# EAGLE design OSO-SAFE-C1-02 (EAGLE 9.4.2)
COMPANY: ADAFRUIT INDUSTRIES; DRAWN: KTOWN; REV: B
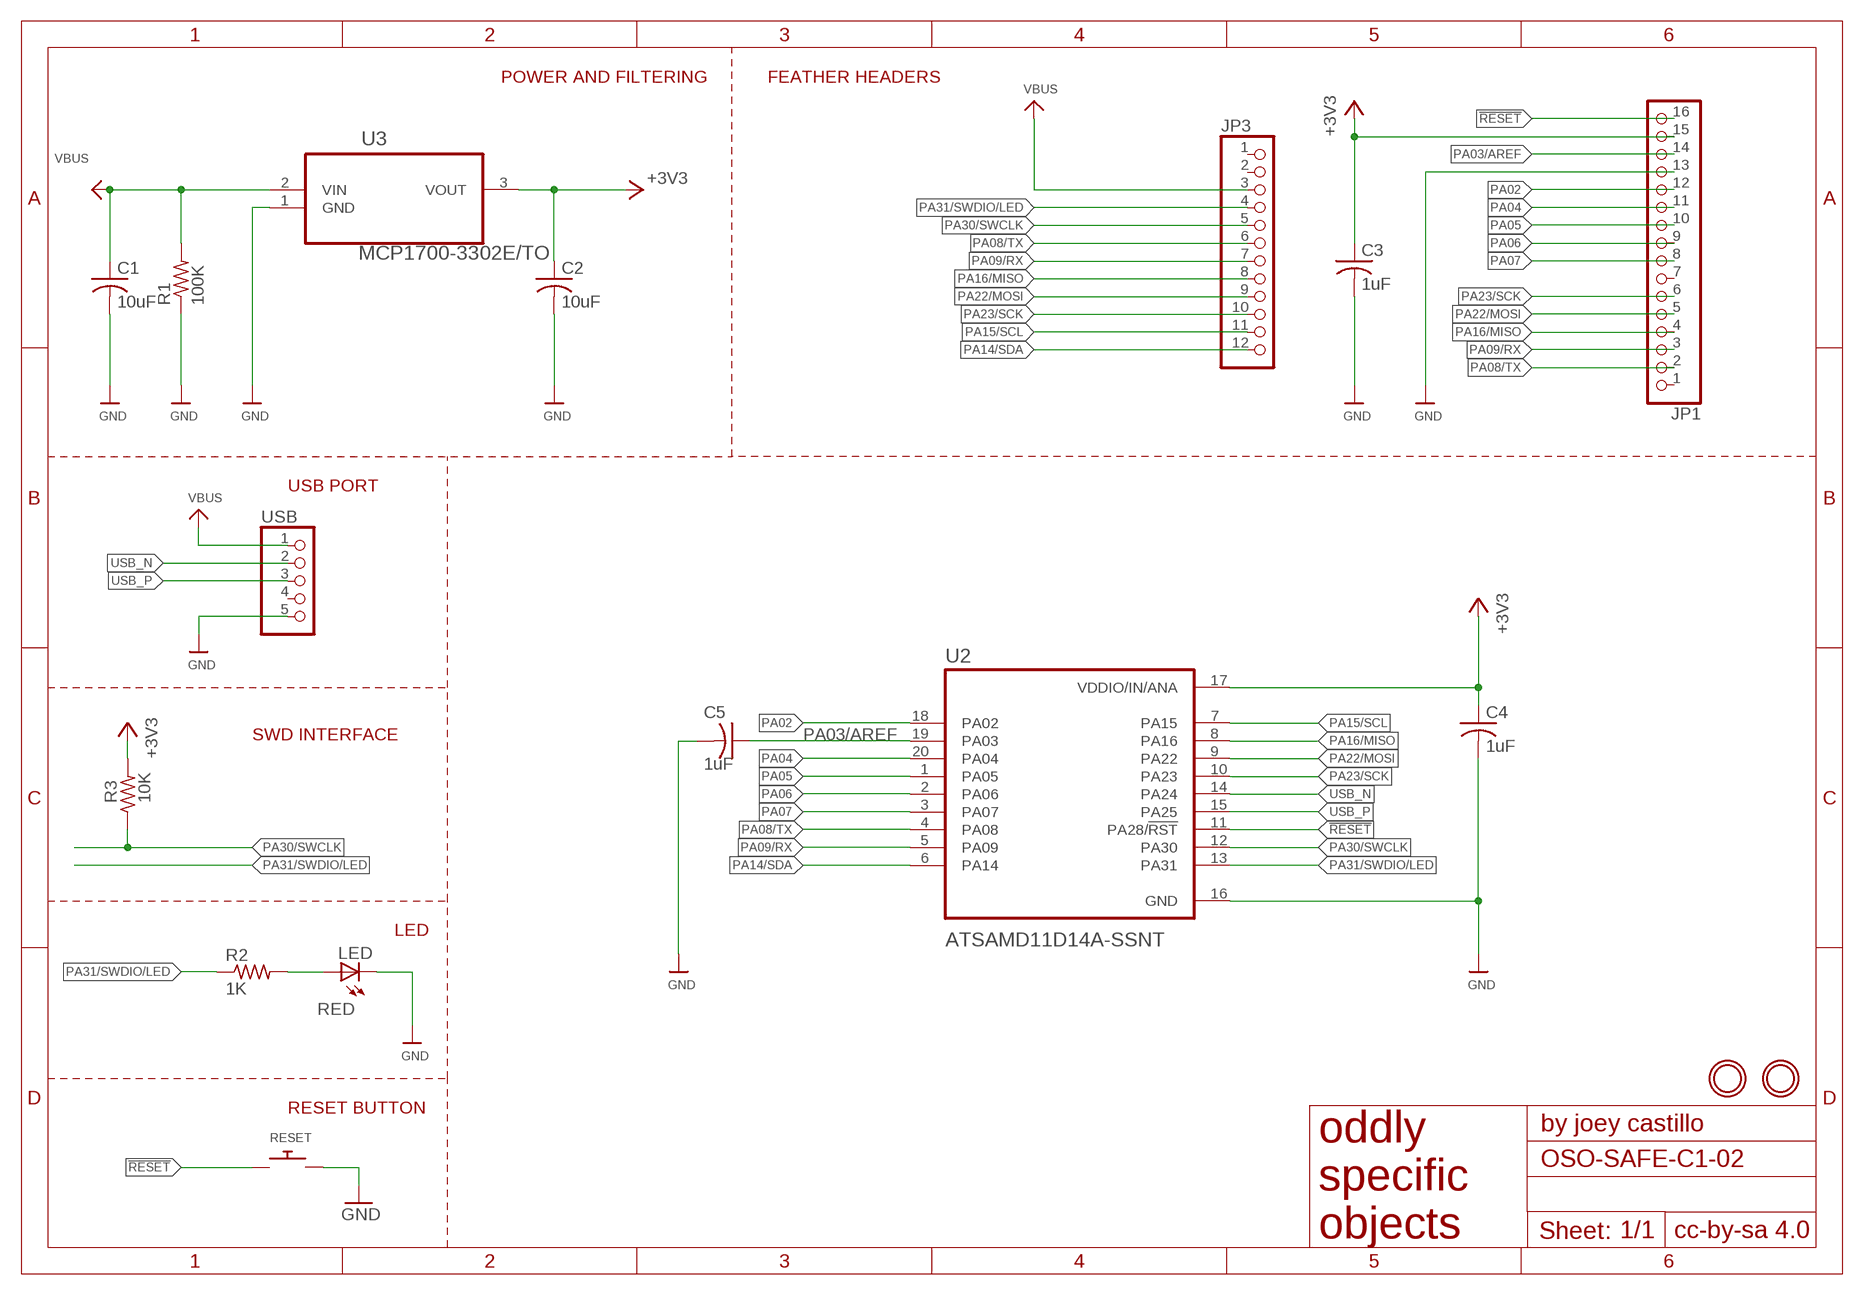
[diagram p0: schematic, sheet 1]

## Parts
C1  10uF  C-US050-025X075  [C050-025X075]
C2  10uF  C-US050-025X075  [C050-025X075]
C3  1uF  C-US025-025X050  [C025-025X050]
C4  1uF  C-US025-025X050  [C025-025X050]
C5  1uF  C-US025-025X050  [C025-025X050]
JP1  HEADER-1X16_MIN  [1X16_ROUND_MIN]
JP3  HEADER-1X12_MIN  [1X12_ROUND_MIN]
LED  RED  LED3MM  [LED3MM]
R1  100K  R-US_0207/9  [0207/9]
R2  1K  R-US_0207/9  [0207/9]
R3  10K  R-US_0207/9  [0207/9]
RESET  SWITCH_PUSHBUTTONEVQ-PE  [TACT_PANA-EVQ]
U2  ATSAMD11D14A-SSNT  [SOIC127P1030X265-20N]
U3  MCP1700-3302E/TO  [TO127P254X495-3]
U$10  MOUNTINGHOLE2.5  [MOUNTINGHOLE_2.5_PLATED]
U$32  MOUNTINGHOLE2.5  [MOUNTINGHOLE_2.5_PLATED]
USB  PINHD-1X5  [1X05]

## Nets
!RESET: JP1.16 RESET.P$1 U2.11(PA28/!RST)
+3V3 [power]: C2.1 C3.1 C4.1 JP1.15 R3.2 U2.17(VDDIO/IN/ANA) U3.3(VOUT)
GND [gnd]: C1.2 C2.2 C3.2 C4.2 C5.2 JP1.13 LED.K(C) R1.1 RESET.P$2 U2.16(GND) U3.1(GND) USB.5
N$1: LED.A R2.2
PA02: JP1.12 U2.18(PA02)
PA03/AREF: C5.1 JP1.14 U2.19(PA03)
PA04: JP1.11 U2.20(PA04)
PA05: JP1.10 U2.1(PA05)
PA06: JP1.9 U2.2(PA06)
PA07: JP1.8 U2.3(PA07)
PA08/TX: JP1.2 JP3.6 U2.4(PA08)
PA09/RX: JP1.3 JP3.7 U2.5(PA09)
PA14/SDA: JP3.12 U2.6(PA14)
PA15/SCL: JP3.11 U2.7(PA15)
PA16/MISO: JP1.4 JP3.8 U2.8(PA16)
PA22/MOSI: JP1.5 JP3.9 U2.9(PA22)
PA23/SCK: JP1.6 JP3.10 U2.10(PA23)
PA30/SWCLK: JP3.5 R3.1 U2.12(PA30)
PA31/SWDIO/LED: JP3.4 R2.1 U2.13(PA31)
USB_N: U2.14(PA24) USB.2
USB_P: U2.15(PA25) USB.3
VBUS [power]: C1.1 JP3.3 R1.2 U3.2(VIN) USB.1
Unconnected: JP1.1 JP1.7 JP3.1 JP3.2 USB.4

## Notes on the sheet
- POWER AND FILTERING | FEATHER HEADERS
- USB PORT
- SWD INTERFACE
- LED
- RESET BUTTON

## Library data of the parts
C1-C5 = adafruit:C-US: CAPACITOR, American symbol
JP1 = microbuilder:HEADER-1X16: PIN HEADER
JP3 = microbuilder:HEADER-1X12
LED = adafruit:LED: LED OSRAM: - CHIPLED LG R971, LG N971, LY N971, LG Q971, LY Q971, LO R971, LY R971 LH N974, LH R974 LS Q976, LO Q976, LY Q976 LO Q996 - Hyper CHIPLED LW Q18S LB Q993, LB Q99A, LB R99A - SideLED LS A670, LO A670, LY A670, LG A670, LP A670 LB A673, LV A673, LT A673, LW A673 LH A674 LY A675 LS A676, LA A676, LO A676, LY A676, LW A676 LS A679, LY A679, LG A679 - Hyper Micro SIDELED® LS Y876, LA Y876, LO Y876, LY Y876 LT Y87S - SmartLED LW L88C, LW L88S LB L89C, LB L89S, LG L890 LS L89K, LO L89K, LY L89K LS L896, LA L896, LO L896, LY L896 - TOPLED LS T670, LO T670, LY T670, LG T670, LP T670 LSG T670, LSP T670, LSY T670, LOP T670, LYG T670 LG T671, LOG T671, LSG T671 LB T673, LV T673, LT T673, LW T673 LH T674 LS T676, LA T676, LO T676, LY T676, LB T676, LH T676, LSB T676, LW T676 LB T67C, LV T67C, LT T67C, LS T67K, LO T67K, LY T67K, LW E67C LS E67B, LA E67B, LO E67B, LY E67B, LB E67C, LV E67C, LT E67C LW T67C LS T679, LY T679, LG T679 LS T770, LO T770, LY T770, LG T770, LP T770 LB T773, LV T773, LT T773, LW T773 LH T774 LS E675, LA E675, LY E675, LS T675 LS T776, LA T776, LO T776, LY T776, LB T776 LHGB T686 LT T68C, LB T68C - Hyper Mini TOPLED® LB M676 - Mini TOPLED Santana® LG M470 LS M47K, LO M47K, LY M47K Source: http://www.osram.convergy.de/
R1-R3 = adafruit:R-US_: RESISTOR, American symbol
RESET = adafruit:SWITCH_PUSHBUTTON: Buttons SOFTTOUCHSMD_SJ - Soft touch temporary push button (Super Junk Akihabara) Compatible with SKPMANE010 [Mouser: 688-SKPMAN] C&K_KSS = Digikey: KSS221GLFS
U2 = ATSAMD11D14A-SSNT:ATSAMD11D14A-SSNT: None; AVAILABILITY: Unavailable; DESCRIPTION: Cortex-M0+, 16kb Flash, 4kb Sram, Usb - 20 Soic, 105c, Green, 1.6-3.6v, 48mhz, Usb/ Eiqj/Soic _s_; MF: Microchip; MP: ATSAMD11D14A-SSNT; PACKAGE: SOIC-20 Atmel; PRICE: None
U3 = MCP1700-3302E_TO:MCP1700-3302E/TO: IC LDO REG 250MA 5.0V; DESCRIPTION: Linear Voltage Regulator IC 1 Output 250mA TO-92-3; DIGI-KEY_PART_NUMBER: MCP1700-3302E/TO-ND; DIGI-KEY_PURCHASE_URL: https://www.digikey.com/product-detail/en/microchip-technology/MCP1700-3302E-TO/MCP1700-3302E-TO-ND/652680?utm_source=snapeda&utm_medium=aggregator&utm_campaign=symbol; MF: Microchip; MP: MCP1700-3302E/TO; PACKAGE: TO-92 Microchip
U$10 U$32 = microbuilder:MOUNTINGHOLE: Mounting Hole For #2 screws (0.086"/2.18mm width, 0.094"/2.4mm hole) use 2.5mm; BOM: EXCLUDE
USB = pinhead:PINHD-1X5: PIN HEADER

## Net classes
0 default: width 0.254 mm, drill 0.254 mm
1 power: width 0.305 mm, drill 0.305 mm
2 gnd: width 0.254 mm, drill 0.254 mm

## Board
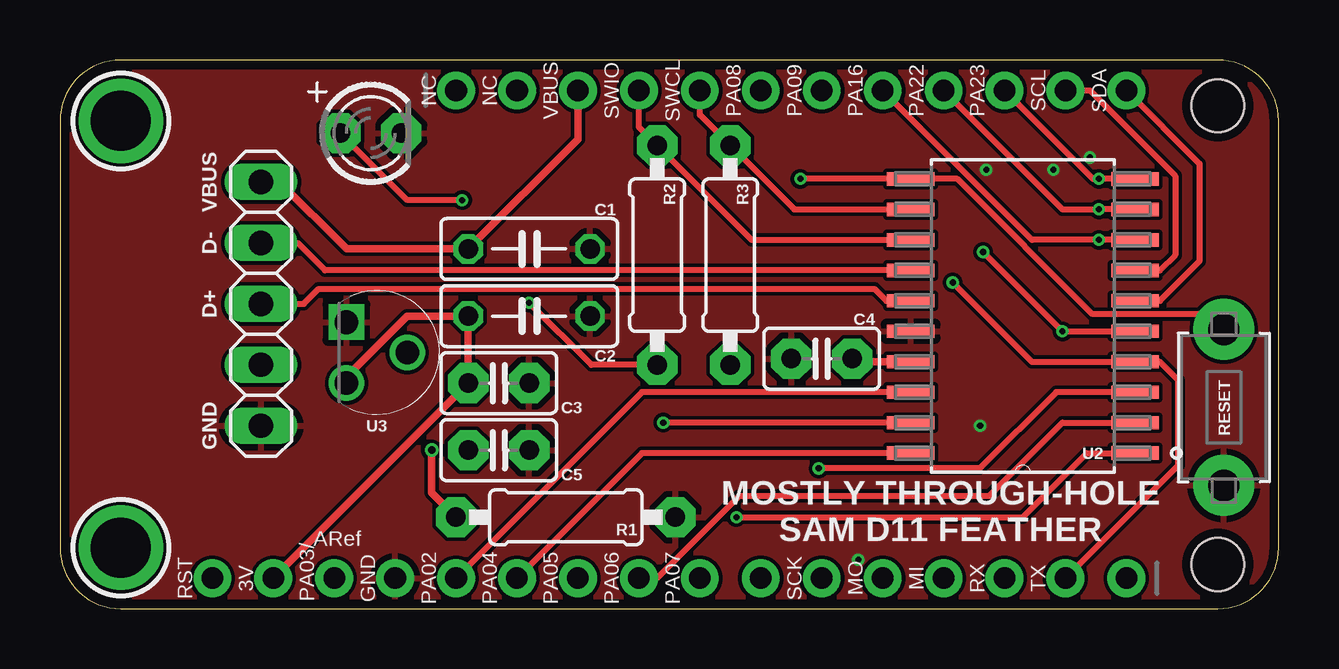
[diagram p1: board, top side]
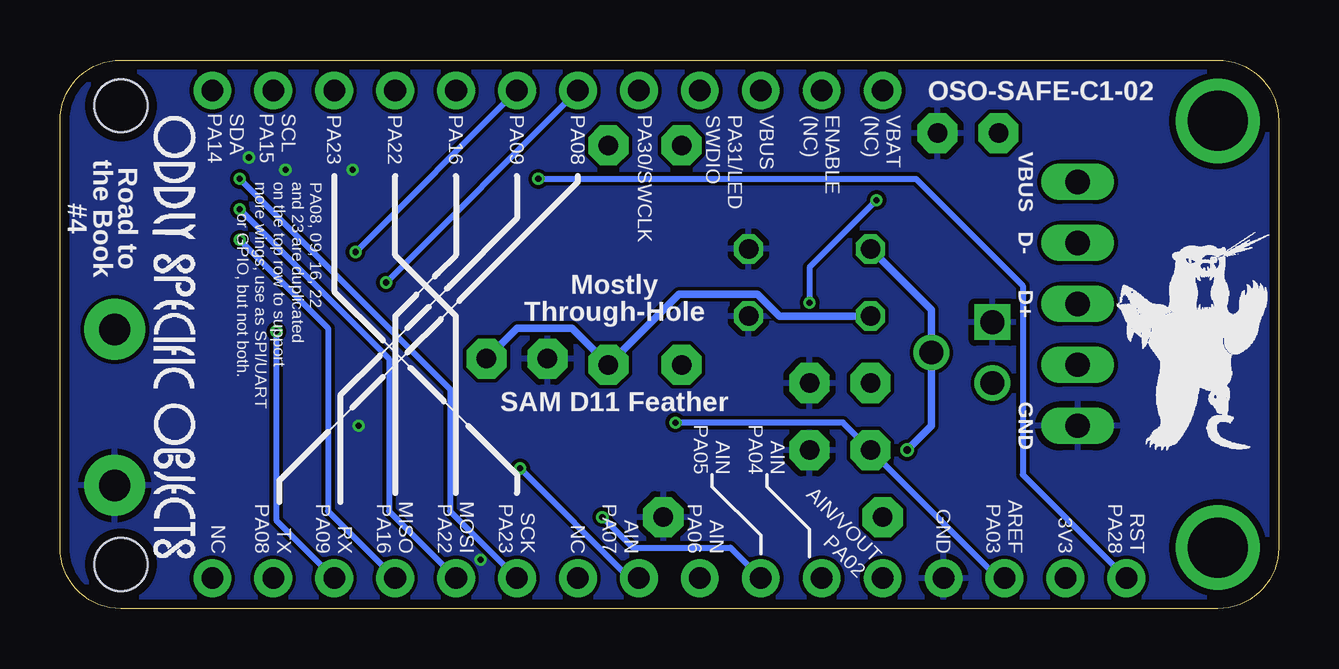
[diagram p2: board, bottom side, seen from below]

Size 50.8 x 22.86 mm. Coordinates in mm from the lower left corner, seen from the top.
Outline: 2.54,0 48.26,0 arc90 50.8,2.54 50.8,20.32 arc90 48.26,22.86 2.54,22.86 arc90 0,20.32 0,2.54 arc90 2.54,0
Copper layers (1*16): Top 0.035559375mm / dielectric 1.6mm / Bottom 0.035559375mm
Design rules "oshpark-2layer *": minimum track width 6mil, minimum drill 10mil, track to track 6mil, track to pad 6mil, pad to pad 6mil, via to via 6mil, smd to smd 6mil, copper to edge 15mil, drill to drill 6mil, minimum pad ring 5mil, minimum via ring 5mil, stop-mask expansion 2.5mil, vias tented up to drill 12mil, thermal gap 10mil
Holes 2.2 mm at 48.26,1.84 48.26,20.95
vRestrict: area 0,2.5 to 10.2,22.9

### Footprints (pad centres in the part's own frame; a part is rotated, then mirrored left to right if it is on the bottom)
C050-025X075 = drill 0.813 octagon: 1 -2.54,0; 2 2.54,0
C025-025X050 = drill 0.813 pad 1.676 octagon: 1 -1.27,0; 2 1.27,0
1X16_ROUND_MIN = drill 0.9 pad 1.575: 1 -19.05,0; 2 -16.51,0; 3 -13.97,0; 4 -11.43,0; 5 -8.89,0; 6 -6.35,0; 7 -3.81,0; 8 -1.27,0; 9 1.27,0; 10 3.81,0; 11 6.35,0; 12 8.89,0; 13 11.43,0; 14 13.97,0; 15 16.51,0; 16 19.05,0
1X12_ROUND_MIN = drill 0.9 pad 1.575: 1 -13.97,0; 2 -11.43,0; 3 -8.89,0; 4 -6.35,0; 5 -3.81,0; 6 -1.27,0; 7 1.27,0; 8 3.81,0; 9 6.35,0; 10 8.89,0; 11 11.43,0; 12 13.97,0
LED3MM = drill 0.813 pad 1.676 octagon: A -1.27,0; K 1.27,0
0207/9 = drill 0.813 pad 1.676 octagon: 1 -4.572,0; 2 4.572,0
TACT_PANA-EVQ = drill 1.3 pad 2.54: P$1 -3.25,0; P$2 3.25,0
SOIC127P1030X265-20N = smd 1.981 x 0.559: 1 -4.674,5.715; 2 -4.674,4.445; 3 -4.674,3.175; 4 -4.674,1.905; 5 -4.674,0.635; 6 -4.674,-0.635; 7 -4.674,-1.905; 8 -4.674,-3.175; 9 -4.674,-4.445; 10 -4.674,-5.715; 11 4.674,-5.715; 12 4.674,-4.445; 13 4.674,-3.175; 14 4.674,-1.905; 15 4.674,-0.635; 16 4.674,0.635; 17 4.674,1.905; 18 4.674,3.175; 19 4.674,4.445; 20 4.674,5.715
TO127P254X495-3 = drill 0.991 square: 1 -2.54,-2.54 | drill 0.991: 2 -1.27,0; 3 0,-2.54
MOUNTINGHOLE_2.5_PLATED = drill 2.5 pad 3.2: P$1 0,0
1X05 = drill 1.016 long: 1 -5.08,0; 2 -2.54,0; 3 0,0; 4 2.54,0; 5 5.08,0

### Placement (x,y rotation side)
C1  19.56,14.99 0 top
C2  19.56,12.19 0 top
C3  18.29,9.4 0 top
C4  31.75,10.41 180 top
C5  18.29,6.6 0 top
JP1  25.4,1.27 180 top
JP3  30.48,21.59 0 top
LED  12.95,19.81 0 top
R1  21.08,3.81 180 top
R2  24.89,14.73 270 top
R3  27.94,14.73 270 top
RESET  48.51,8.38 270 top
U2  40.13,12.19 180 top
U3  14.48,9.4 270 top
U$8  [OSO_WORDMARK_ONELINE_725MIL_1000DPI]  46.99,20.57 270 bottom
U$9  [OSO_BEAR_250X360MIL_1000DPI]  3.56,11.18 0 bottom
U$10  2.54,20.32 0 top
U$32  2.54,2.54 270 top
USB  8.38,12.7 270 top

### Tracks (layer width: path | path; a pad name or v marks a point on that pad's centre or on a via)
!RESET  (via drill 0.25)
  Top 0.254: RESET.P$1 48.26,11.63 47.62,12.27 43.04,12.27 37.4,17.91 U2.11 v30.86,17.91
  Bottom 0.254: JP1.16 10.67,5.59 10.67,13.46 15.11,17.91 v30.86,17.91
+3V3
  Top 0.305: U2.17 33.15,10.29 C4.1 | JP1.15 C3.1 C2.1 14.48,12.19 11.94,9.65 U3.3
  Bottom 0.305: C2.1 20.8,12.19 21.72,13.11 24.99,13.11 R3.2 29.46,11.68 31.75,11.68 C4.1
GND  (via drill 0.25)
  other vias: 42.93,18.8 41.4,18.29 38.61,18.29 38.35,7.62 33.27,2.03
  pour Top: -0.25,22.86 -0.25,0 50.93,0 50.93,22.86
  pour Bottom: 0,0 51.18,0 51.18,22.86 0,22.86
N$1  (via drill 0.25)
  Top 0.254: R2.2 22.15,10.16 v19.56,12.75 | v16.76,17.02 14.48,17.02 LED.A
  Bottom 0.254: v19.56,12.75 19.56,14.22 v16.76,17.02
PA02
  Top 0.254: U2.18 24.26,9.02 JP1.12
PA03/AREF  (via drill 0.25)
  Top 0.254: U2.19 v25.15,7.75
  Bottom 0.254: v25.15,7.75 18.16,7.75 C5.1 11.68,1.27 JP1.14
PA04
  Top 0.254: U2.20 24.26,6.48 JP1.11
PA05  (via drill 0.25)
  Top 0.254: v28.19,3.81 40.13,3.81 42.8,6.48 U2.1
  Bottom 0.254: JP1.10 22.86,2.54 26.92,2.54 v28.19,3.81
PA06
  Top 0.254: JP1.9 24.89,1.27 28.32,4.7 38.73,4.7 41.78,7.75 U2.2
PA07  (via drill 0.25)
  Top 0.254: v31.62,5.84 38.35,5.84 41.53,9.02 U2.3
  Bottom 0.254: JP1.8 27.05,1.27 v31.62,5.84
PA08/TX  (via drill 0.25)
  Top 0.254: JP1.2 46.61,5.97 46.61,9.53 45.85,10.29 U2.4 40.51,10.29 v37.21,13.59
  Bottom 0.254: v37.21,13.59 JP3.6
PA09/RX  (via drill 0.25)
  Top 0.254: U2.5 v41.78,11.56 v38.48,14.86
  Bottom 0.254: v41.78,11.56 41.78,3.68 JP1.3 | JP3.7 v38.48,14.86
PA14/SDA
  Top 0.254: U2.6 45.85,12.83 47.5,14.48 47.5,18.54 JP3.12
PA15/SCL
  Top 0.254: JP3.11 42.93,21.59 46.48,18.03 46.48,14.73 45.85,14.1 U2.7
PA16/MISO  (via drill 0.25)
  Top 0.254: U2.8 v43.31,15.37 40.51,15.37 JP3.8
  Bottom 0.254: v43.31,15.37 39.62,11.68 39.62,4.06 JP1.4
PA22/MOSI  (via drill 0.25)
  Top 0.254: U2.9 v43.31,16.64 41.78,16.64 JP3.9
  Bottom 0.254: v43.31,16.64 37.08,10.41 37.08,4.06 JP1.5
PA23/SCK  (via drill 0.25)
  Top 0.254: U2.10 v43.31,17.91 43.05,17.91 JP3.10
  Bottom 0.254: v43.31,17.91 34.54,9.14 34.54,4.06 JP1.6
PA30/SWCLK
  Top 0.254: U2.12 30.61,16.64 R3.1 26.67,20.57 JP3.5
PA31/SWDIO/LED
  Top 0.254: U2.13 28.83,15.37 R2.1 24.13,20.07 JP3.4
USB_N
  Top 0.254: USB.2 9.91,15.24 11.05,14.1 U2.14
USB_P
  Top 0.254: U2.15 34.44,12.83 33.95,13.32 10.78,13.32 10.16,12.7 USB.3
VBUS  (via drill 0.3)
  Top 0.305: USB.1 9.14,17.78 11.94,14.99 C1.1 21.59,19.56 JP3.3 | R1.2 15.49,4.83 v15.49,6.6
  Bottom 0.305: v15.49,6.6 14.48,7.62 U3.2 14.48,12.45 C1.1

### Text on the board
tPlace: NC | NC | VBUS | SWIO | SWCL | PA08 | PA09 | PA16 | PA22 | PA23 | SCL | SDA | VBUS | D- | D+ | GND | MOSTLY THROUGH-HOLE / SAM D11 FEATHER | ARef | PA03/ | RST | 3V | GND | PA02 | PA04 | PA05 | PA06 | PA07 | SCK | MO | MI | RX | TX
bPlace: OSO-SAFE-C1-02 | VBAT / (NC) | ENABLE / (NC) | VBUS | PA31/LED / SWDIO | PA30/SWCLK | PA08 | PA09 | PA16 | PA22 | PA23 | SCL / PA15 | SDA / PA14 | VBUS | PA08, 09, 16, 22 / and 23 are duplicated / on the top row to support / more wings; use as SPI/UART / or GPIO, but not both. | Road to / the Book / #4 | D- | D+ | Mostly / Through-Hole | SAM D11 Feather | GND | AIN / PA04 | AIN / PA05 | RST / PA28 | 3V3 | AREF / PA03 | GND | AIN/VOUT / PA02 | AIN / PA06 | AIN / PA07 | NC | SCK / PA23 | MOSI / PA22 | MISO / PA16 | RX / PA09 | TX / PA08 | NC
tDocu: 13 | 12 | 11 | 10 | 9 | 6 | 5 | 8 | 7 | 14 | 5 | 6 | 9 | 10 | 11 | 0/A0 | 1/A1 | 2/A2 | 3/A3 | 4/A4 | USB pins: 15/16